# EAGLE design Version1 (EAGLE 8.2.1)
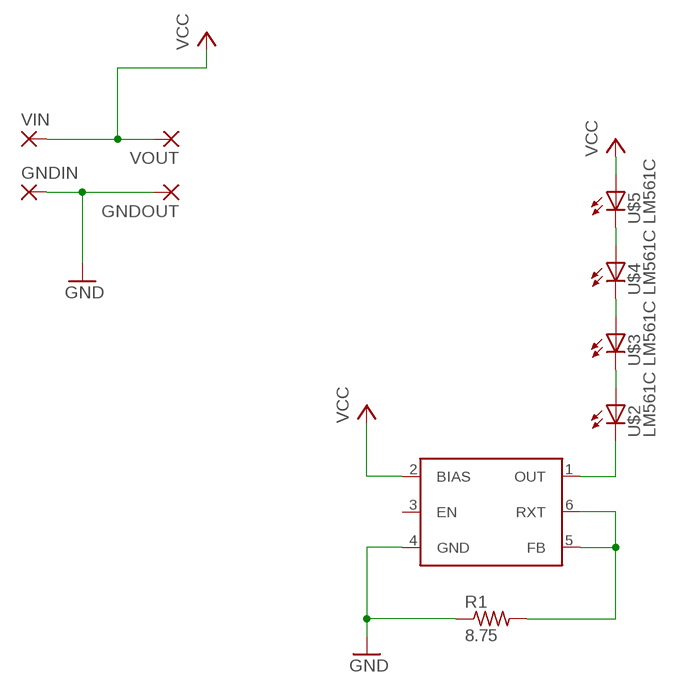
[diagram p0: schematic, sheet 1]

## Parts
GNDIN  SMD5  [SMD2,54-5,08]
GNDOUT  SMD5  [SMD2,54-5,08]
R1  8.75  R-US_R0805  [R0805]
U$1  AL5802  [SOT26]
U$2  LM561C  [LM561CPAD]
U$3  LM561C  [LM561CPAD]
U$4  LM561C  [LM561CPAD]
U$5  LM561C  [LM561CPAD]
VIN  SMD5  [SMD2,54-5,08]
VOUT  SMD5  [SMD2,54-5,08]

## Nets
GND: GNDIN.1(P) GNDOUT.1(P) R1.1 U$1.4(GND)
N$1: R1.2 U$1.5(FB) U$1.6(RXT)
N$2: U$4.ANODE(A) U$5.CATH(C)
N$3: U$3.ANODE(A) U$4.CATH(C)
N$4: U$2.ANODE(A) U$3.CATH(C)
N$5: U$1.1(OUT) U$2.CATH(C)
VCC: U$1.2(BIAS) U$5.ANODE(A) VIN.1(P) VOUT.1(P)
Unconnected: U$1.3(EN)

## Library data of the parts
GNDIN GNDOUT VIN VOUT = wirepad:SMD5: SMD PAD
R1 = adafruit:R-US_: RESISTOR, American symbol
U$1 = ccs:AL5802
U$2-U$5 = ccs:LM561C

## Board
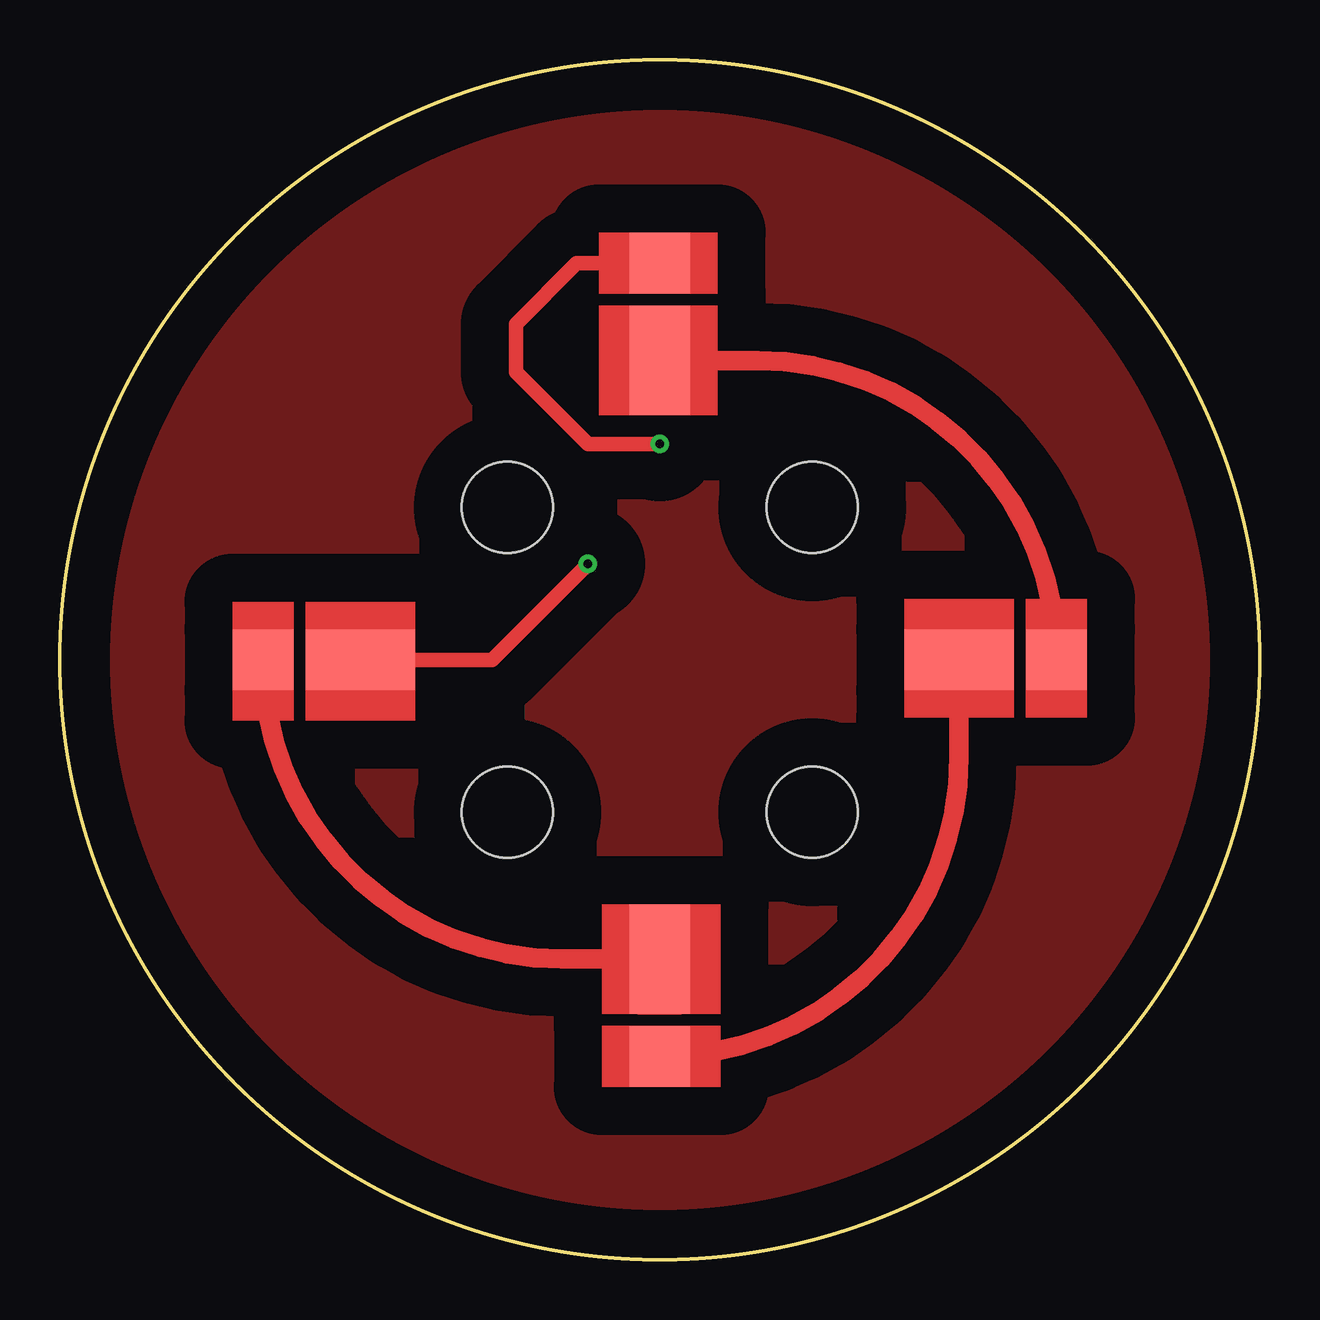
[diagram p1: board, top side]
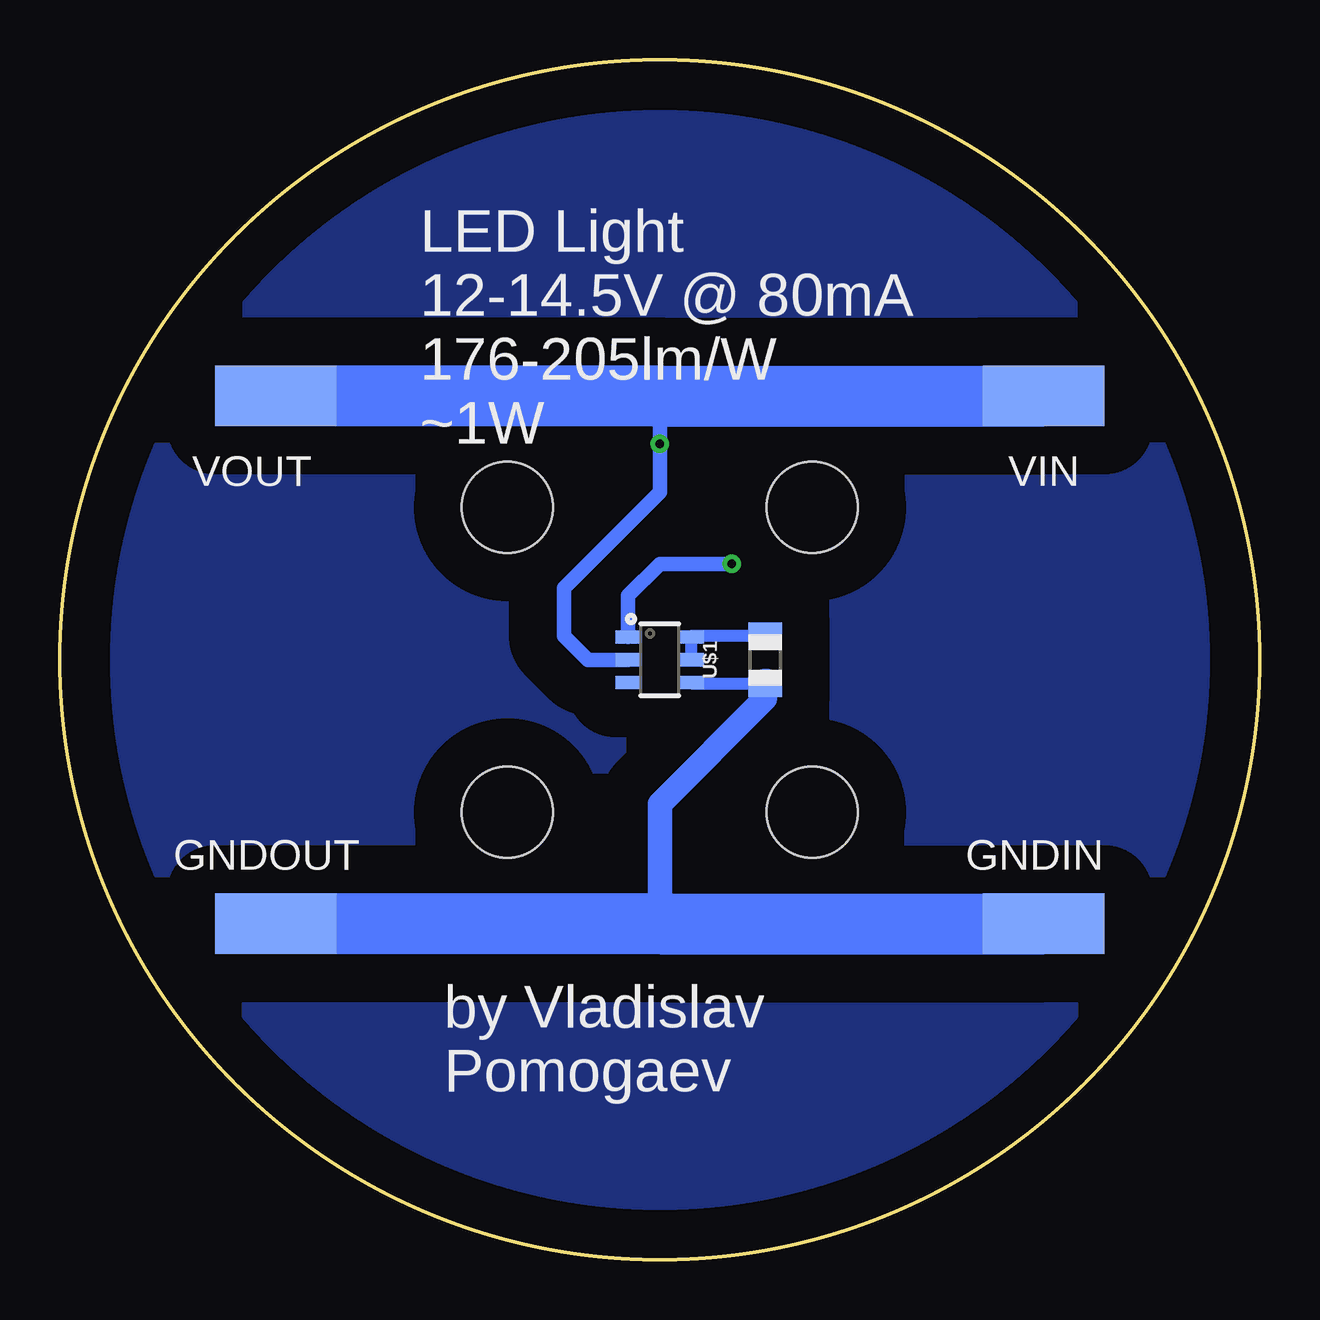
[diagram p2: board, bottom side, seen from below]

Size 50 x 50 mm. Coordinates in mm from the lower left corner, seen from the top.
Outline: circle at 25,25 radius 25
Copper layers (1*16): Top 0.035mm / dielectric 1.5mm / Bottom 0.035mm
Design rules "default": minimum track width 6mil, minimum drill 0.35mm, track to track 6mil, track to pad 6mil, pad to pad 6mil, via to via 6mil, smd to smd 6mil, copper to edge 40mil, drill to drill 6mil, minimum pad ring 10mil, minimum via ring 8mil, stop-mask expansion 4mil, vias tented up to drill 0mil, thermal gap 10mil
Holes 3.8 mm at 31.35,31.35 31.35,18.65 18.65,31.35 18.65,18.65

### Footprints (pad centres in the part's own frame; a part is rotated, then mirrored left to right if it is on the bottom)
SMD2,54-5,08 = smd 2.54 x 5.08: 1 0,0
R0805 = smd 1.1 x 1.4: 1 -1,0; 2 1,0
SOT26 = smd 0.55 x 1.054: 1 -0.95,-1.327; 2 0,-1.327; 3 0.95,-1.327; 4 0.95,1.327; 5 0,1.327; 6 -0.95,1.327
LM561CPAD = smd 2.54 x 2.54: ANODE 2.54,0 | smd 4.572 x 2.54: CATH -1.524,0

### Placement (x,y rotation side)
GNDIN  9,14 90 bottom
GNDOUT  41,14 90 bottom
R1  20.61,25 90 bottom
U$1  25,25 270 bottom
U$2  11,25 180 top
U$3  25,11 270 top
U$4  39,25 0 top
U$5  25,39 90 top
VIN  9,36 90 bottom
VOUT  41,36 90 bottom

### Tracks (layer width: path | path; a pad name or v marks a point on that pad's centre or on a via)
GND
  Bottom 0.508: R1.1 23.62,24 U$1.4
  Bottom 1.016: R1.1 20.61,23.39 25,19 25,14
  Bottom 1.27: 20.55,24 R1.1
  Bottom 2.54: GNDIN.1 25,14 GNDOUT.1
N$1
  Bottom 0.508: U$1.6 23.67,26 | U$1.5 U$1.6 | R1.2 23.62,26 U$1.6
N$2
  Top 0.813: U$4.ANODE arc90 29.06,37.48 U$5.CATH
N$3
  Top 0.813: U$3.ANODE arc90 37.48,20.94 U$4.CATH
N$4
  Top 0.813: U$2.ANODE arc90 20.94,12.52 U$3.CATH
N$5  (via drill 0.35)
  Top 0.61: U$2.CATH 18,25 v22,29
  Bottom 0.61: U$1.1 26.33,27.67 25,29 v22,29
N$7
  pour Top (isolate 2): 0,25 arc-90 25,50 arc-90 50,25 arc-90 25,0 arc-90
N$8
  pour Bottom (isolate 2): 0,25 arc-90 25,50 arc-90 50,25 arc-90 25,0 arc-90
VCC  (via drill 0.35)
  Top 0.61: U$5.ANODE 21.54,41.54 19,39 19,37 22,34 v25,34
  Bottom 0.61: U$1.2 28,25 29,26 29,28 25,32 v25,34 25,36
  Bottom 2.54: VIN.1 25,36 VOUT.1

### Text on the board
bNames: LED Light / 12-14.5V @ 80mA / 176-205lm/W / ~1W | by Vladislav / Pomogaev